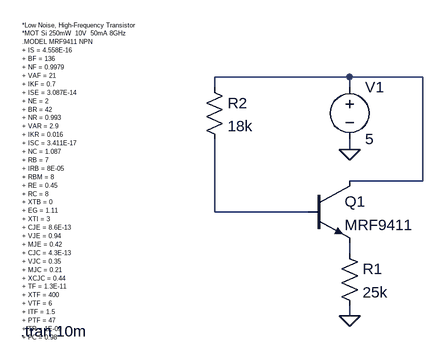
[diagram p0: schematic MRF9411_DC.asc]
MRF9411_DC.asc, the LTspice schematic file:
Version 4
SHEET 1 880 680
WIRE 448 -48 240 -48
WIRE 560 -48 448 -48
WIRE 240 -32 240 -48
WIRE 448 -32 448 -48
WIRE 448 64 448 48
WIRE 560 112 560 -48
WIRE 560 112 448 112
WIRE 240 160 240 48
WIRE 384 160 240 160
WIRE 448 224 448 208
WIRE 448 320 448 304
FLAG 448 320 0
FLAG 448 64 0
SYMBOL npn 384 112 R0
SYMATTR InstName Q1
SYMATTR Value MRF9411
SYMBOL voltage 448 -48 R0
WINDOW 123 0 0 Left 0
WINDOW 39 0 0 Left 0
SYMATTR InstName V1
SYMATTR Value 5
SYMBOL res 432 208 R0
SYMATTR InstName R1
SYMATTR Value 25k
SYMBOL res 224 -48 R0
SYMATTR InstName R2
SYMATTR Value 18k
TEXT -56 -128 Left 0 !*Low Noise, High-Frequency Transistor\n*MOT Si 250mW  10V  50mA 8GHz \n.MODEL MRF9411 NPN \n+ IS = 4.558E-16 \n+ BF = 136 \n+ NF = 0.9979 \n+ VAF = 21 \n+ IKF = 0.7 \n+ ISE = 3.087E-14 \n+ NE = 2 \n+ BR = 42 \n+ NR = 0.993 \n+ VAR = 2.9 \n+ IKR = 0.016 \n+ ISC = 3.411E-17 \n+ NC = 1.087 \n+ RB = 7 \n+ IRB = 8E-05 \n+ RBM = 8 \n+ RE = 0.45 \n+ RC = 8 \n+ XTB = 0 \n+ EG = 1.11 \n+ XTI = 3 \n+ CJE = 8.6E-13 \n+ VJE = 0.94 \n+ MJE = 0.42 \n+ CJC = 4.3E-13 \n+ VJC = 0.35 \n+ MJC = 0.21 \n+ XCJC = 0.44 \n+ TF = 1.3E-11 \n+ XTF = 400 \n+ VTF = 6 \n+ ITF = 1.5 \n+ PTF = 47 \n+ TR = 1E-09 \n+ FC = 0.98
TEXT -58 344 Left 2 !.tran 10m

The netlist it stands for:
* MRF9411_DC.asc
Q1 N001 N002 N003 0 MRF9411
V1 N001 0 5
R1 N003 0 25k
R2 N001 N002 18k
.model NPN NPN
.model PNP PNP
.lib standard.bjt
*Low Noise, High-Frequency Transistor
*MOT Si 250mW  10V  50mA 8GHz
.MODEL MRF9411 NPN
+ IS = 4.558E-16
+ BF = 136
+ NF = 0.9979
+ VAF = 21
+ IKF = 0.7
+ ISE = 3.087E-14
+ NE = 2
+ BR = 42
+ NR = 0.993
+ VAR = 2.9
+ IKR = 0.016
+ ISC = 3.411E-17
+ NC = 1.087
+ RB = 7
+ IRB = 8E-05
+ RBM = 8
+ RE = 0.45
+ RC = 8
+ XTB = 0
+ EG = 1.11
+ XTI = 3
+ CJE = 8.6E-13
+ VJE = 0.94
+ MJE = 0.42
+ CJC = 4.3E-13
+ VJC = 0.35
+ MJC = 0.21
+ XCJC = 0.44
+ TF = 1.3E-11
+ XTF = 400
+ VTF = 6
+ ITF = 1.5
+ PTF = 47
+ TR = 1E-09
+ FC = 0.98
.tran 10m
.backanno
.end